# EAGLE design photonNixieBottom (EAGLE 9.0.0)
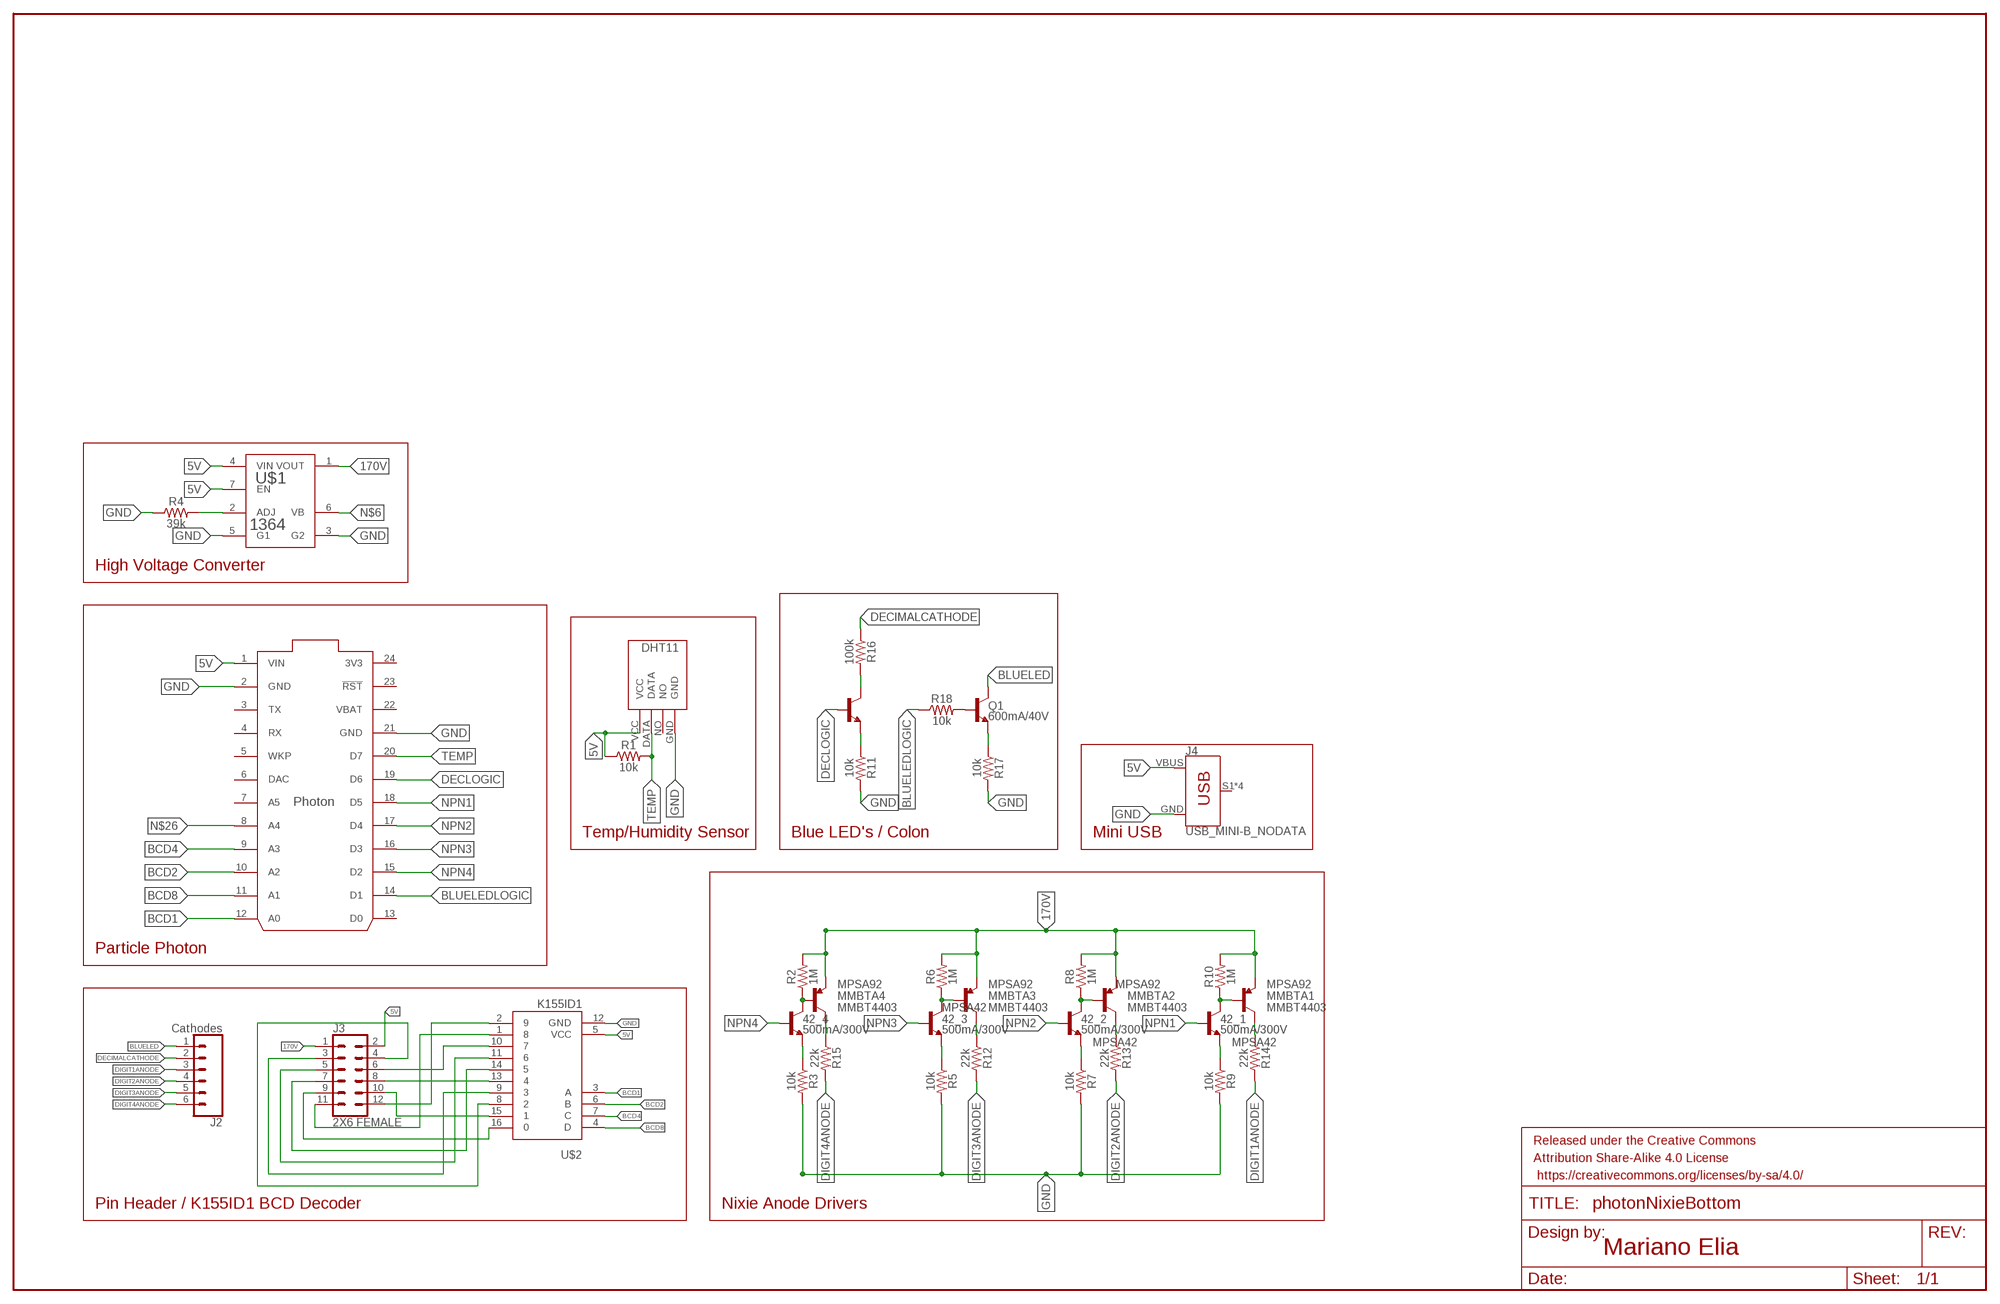
[diagram p0: schematic, sheet 1]

## Parts
42_1  500mA/300V  TRANS_NPN-MMBTA42  [SOT23-3]
42_2  500mA/300V  TRANS_NPN-MMBTA42  [SOT23-3]
42_3  500mA/300V  TRANS_NPN-MMBTA42  [SOT23-3]
42_4  500mA/300V  TRANS_NPN-MMBTA42  [SOT23-3]
FRAME1  FRAME-LEDGER  [CREATIVE_COMMONS]
J2  Cathodes  CONN_06NO_SILK_FEMALE_PTH  [1X06_NO_SILK]
J3  2X6 FEMALE  CONN_06X2PTH_FEMALE  [2X6]
J4  USB_MINI-B_NODATA  [USB-MINIB_NODATA]
MMBTA1  MMBT4403  TRANSISTOR_PNPMMBT4403  [SOT23-3]
MMBTA2  MMBT4403  TRANSISTOR_PNPMMBT4403  [SOT23-3]
MMBTA3  MMBT4403  TRANSISTOR_PNPMMBT4403  [SOT23-3]
MMBTA4  MMBT4403  TRANSISTOR_PNPMMBT4403  [SOT23-3]
MPSA7  500mA/300V  TRANS_NPN-MMBTA42  [SOT23-3]
Q1  600mA/40V  TRANS_NPN-MMBT2222AL  [SOT23-3]
R1  10k  0.3OHM-0805-1/8W-1%  [0805]
R2  1M  0.75OHM-0805-1/4W-1%  [0805]
R3  10k  0.75OHM-0805-1/4W-1%  [0805]
R4  39k  0.3OHM-0805-1/8W-1%  [0805]
R5  10k  0.75OHM-0805-1/4W-1%  [0805]
R6  1M  0.75OHM-0805-1/4W-1%  [0805]
R7  10k  0.75OHM-0805-1/4W-1%  [0805]
R8  1M  0.75OHM-0805-1/4W-1%  [0805]
R9  10k  0.75OHM-0805-1/4W-1%  [0805]
R10  1M  0.75OHM-0805-1/4W-1%  [0805]
R11  10k  0.75OHM-0805-1/4W-1%  [0805]
R12  22k  0.75OHM-0805-1/4W-1%  [0805]
R13  22k  0.75OHM-0805-1/4W-1%  [0805]
R14  22k  0.75OHM-0805-1/4W-1%  [0805]
R15  22k  0.75OHM-0805-1/4W-1%  [0805]
R16  100k  0.75OHM-0805-1/4W-1%  [0805]
R17  10k  0.75OHM-0805-1/4W-1%  [0805]
R18  10k  0.75OHM-0805-1/4W-1%  [0805]
U$1  1364  [1364]
U$2  K155ID1  [DIL16-KIT]
U$3  Temp/Humidity  DHT11  [DHT11]
U$4  PHOTON_SMDNOSILK  [PHOTON_SMDNOSILK]

## Nets
5V: J3.2 J4.VBUS R1.1 U$1.4(VIN) U$1.7(EN) U$2.5(VCC) U$3.VCC U$4.1(VIN)
170V: J3.1 MMBTA1.2(E) MMBTA2.2(E) MMBTA3.2(E) MMBTA4.2(E) R2.2 R6.2 R8.2 R10.2 U$1.1(VOUT)
BCD1: U$2.3(A) U$4.12(A0)
BCD2: U$2.6(B) U$4.10(A2)
BCD4: U$2.7(C) U$4.9(A3)
BCD8: U$2.4(D) U$4.11(A1)
BLUELED: J2.1 Q1.3(C)
BLUELEDLOGIC: R18.1 U$4.14(D1)
DECIMALCATHODE: J2.2 R16.1
DECLOGIC: MPSA7.1(B) U$4.19(D6)
DIGIT1ANODE: J2.3 R14.2
DIGIT2ANODE: J2.4 R13.2
DIGIT3ANODE: J2.5 R12.2
DIGIT4ANODE: J2.6 R15.2
GND: J4.GND R3.2 R4.1 R5.2 R7.2 R9.2 R11.2 R17.2 U$1.3(G2) U$1.5(G1) U$2.12(GND) U$3.GND U$4.2(GND) U$4.21(GND)
N$1: J3.11 U$2.1
N$2: J3.12 U$2.2
N$3: R4.2 U$1.2(ADJ)
N$4: J3.9 U$2.16
N$5: J3.10 U$2.15
N$6: U$1.6(VB)
N$7: J3.7 U$2.14
N$8: J3.8 U$2.13
N$9: J3.5 U$2.11
N$10: J3.6 U$2.10
N$11: J3.3 U$2.9
N$12: 42_4.2(E) R3.1
N$14: 42_3.2(E) R5.1
N$15: 42_4.3(C) MMBTA4.1(B) R2.1
N$16: MPSA7.2(E) R11.1
N$17: 42_2.2(E) R7.1
N$18: 42_2.3(C) MMBTA2.1(B) R8.1
N$19: J3.4 U$2.8
N$20: 42_1.2(E) R9.1
N$21: 42_1.3(C) MMBTA1.1(B) R10.1
N$22: 42_3.3(C) MMBTA3.1(B) R6.1
N$23: MMBTA3.3(C) R12.1
N$24: MMBTA4.3(C) R15.1
N$25: MMBTA2.3(C) R13.1
N$26: U$4.8(A4)
N$27: MMBTA1.3(C) R14.1
N$28: MPSA7.3(C) R16.2
N$29: Q1.1(B) R18.2
N$31: Q1.2(E) R17.1
NPN1: 42_1.1(B) U$4.18(D5)
NPN2: 42_2.1(B) U$4.17(D4)
NPN3: 42_3.1(B) U$4.16(D3)
NPN4: 42_4.1(B) U$4.15(D2)
TEMP: R1.2 U$3.DATA U$4.20(D7)
Unconnected: J4.S1(SHIELD) J4.S2(SHIELD) J4.S3(SHIELD) J4.S4(SHIELD) U$3.NO U$4.3(TX) U$4.4(RX) U$4.5(WKP) U$4.6(DAC) U$4.7(A5) U$4.13(D0) U$4.23(!RST)

## Notes on the sheet
- High Voltage Converter
- Temp/Humidity Sensor | Blue LED's / Colon | Mini USB
- Particle Photon
- Pin Header / K155ID1 BCD Decoder | Nixie Anode Drivers
- Mariano Elia

## Power pins joined to a net without a drawn wire
3V3: U$4.24(3V3)
VBAT: U$4.22(VBAT)

## Library data of the parts
42_1-42_4 MPSA7 = SparkFun-DiscreteSemi:TRANS_NPN: NPN transistor Current controlled devices typically used to amplify current or used as a switch. BC547 - COM-08928 <http://www.sparkfun.com/products/8928> (TO-92 45V 100mA) (1.Collector 2.Base 3.Emitter) 2N3904 - COM-00521 <http://www.sparkfun.com/products/521> (TO-92 40V 200mA) (1.Emitter 2.Base 3.Collector) P2N2222A - COM-12852 <http://www.sparkfun.com/products/12852> (TO-92 40V 600mA) (1.Collector 2.Base 3.Emitter); PROD_ID: TRANS-09116
FRAME1 = SparkFun-Aesthetics:FRAME-LEDGER: Schematic Frame - Ledger Standard 11x14 US Ledger frame
J2 = SparkFun-Connectors:CONN_06: Multi connection point. Often used as Generic Header-pin footprint for 0.1 inch spaced/style header connections On any of the 0.1 inch spaced packages, you can populate with these: Break Away Headers - Straight <https://www.sparkfun.com/products/116> (PRT-00116) Break Away Male Headers - Right Angle <https://www.sparkfun.com/products/553> (PRT-00553) Female Headers <https://www.sparkfun.com/products/115> (PRT-00115) Break Away Headers - Machine Pin <https://www.sparkfun.com/products/117> (PRT-00117) Break Away Female Headers - Swiss Machine Pin <https://www.sparkfun.com/products/743> (PRT-00743) Arduino Stackable Header - 6 Pin <https://www.sparkfun.com/products/9280> (PRT-09280) For SCREWTERMINALS and SPRING TERMINALS visit here: Screw Terimnals on SparkFun.com <https://www.sparkfun.com/search/results?term=Screw+Terminals> (5mm/3.5mm/2.54mm spacing) This device is also useful as a general connection point to wire up your design to another part of your project. Our various solder wires solder well into these plated through hole pads. Hook-Up Wire - Assortment (Stranded, 22 AWG) <https://www.sparkfun.com/products/11375> (PRT-11375) Hook-Up Wire - Assortment (Solid Core, 22 AWG) <https://www.sparkfun.com/products/11367> (PRT-11367) View the entire wire category on our website here <https://www.sparkfun.com/categories/141>; PROD_ID: CONN-08437
J3 = SparkFun-Connectors:CONN_06X2: Multi connection point. Often used as Generic Header-pin footprint for 0.1 inch spaced/style header connections On any of the 0.1 inch spaced packages, you can populate with these: Break Away Headers - Straight <https://www.sparkfun.com/products/116> (PRT-00116) Break Away Male Headers - Right Angle <https://www.sparkfun.com/products/553> (PRT-00553) Female Headers <https://www.sparkfun.com/products/115> (PRT-00115) Break Away Headers - Machine Pin <https://www.sparkfun.com/products/117> (PRT-00117) Break Away Female Headers - Swiss Machine Pin <https://www.sparkfun.com/products/743> (PRT-00743); PROD_ID: CONN-12423
J4 = Mariano-SparkFun-Connectors:USB_MINI-B_NODATA: USB type Mini-B Connector Breaks out 5th pin, and includes shield pins if needed. SparkFun Products: SparkFun FTDI Basic Breakout <https://www.sparkfun.com/products/9716> SparkFun XBee Explorer USB <https://www.sparkfun.com/products/11812> SparkFun Redboard <https://www.sparkfun.com/products/12757>
MMBTA1-MMBTA4 = User-Submitted:TRANSISTOR_PNP: Generic PNP BJT Double check pinouts against datasheets- not all devices are the same! MMBT3906 - 40V 200mA SOT-23 (TRANS-08052) MMBT4403 - 40V 600mA SOT-23 (TRANS-09245); PROD_ID: TRANS-09245
Q1 = SparkFun-DiscreteSemi:TRANS_NPN: NPN transistor Current controlled devices typically used to amplify current or used as a switch. BC547 - COM-08928 <http://www.sparkfun.com/products/8928> (TO-92 45V 100mA) (1.Collector 2.Base 3.Emitter) 2N3904 - COM-00521 <http://www.sparkfun.com/products/521> (TO-92 40V 200mA) (1.Emitter 2.Base 3.Collector) P2N2222A - COM-12852 <http://www.sparkfun.com/products/12852> (TO-92 40V 600mA) (1.Collector 2.Base 3.Emitter); PROD_ID: TRANS-08049
R1 R4 = SparkFun-Resistors:0.3OHM: 0.3Ω resistor A resistor is a passive two-terminal electrical component that implements electrical resistance as a circuit element. Resistors act to reduce current flow, and, at the same time, act to lower voltage levels within circuits. - Wikipedia; PROD_ID: RES-11622; VALUE: 0.3
R2 R3 R5-R18 = SparkFun-Resistors:0.75OHM: 0.75Ω resistor A resistor is a passive two-terminal electrical component that implements electrical resistance as a circuit element. Resistors act to reduce current flow, and, at the same time, act to lower voltage levels within circuits. - Wikipedia; PROD_ID: RES-08474; VALUE: 0.75
U$1 = TES:1364: TES1364 HVPS Horizontal module
U$2 = Nixie:K155ID1
U$3 = DHT11:DHT11: DHT11 Czujnik temperatury i wilgotności
U$4 = MarianoSpark:PHOTON_SMDNOSILK: Photon (without headers) - designed to be surface mounted with 7 extra exposed pads on the bottom of the board which include, 3 RGB LED outputs, /SETUP, EN (3.3V SMPS enable input), USB D+ and USB D-.

## Net classes
0 default: width 0.406 mm
1 GND: width 0.61 mm

## Board
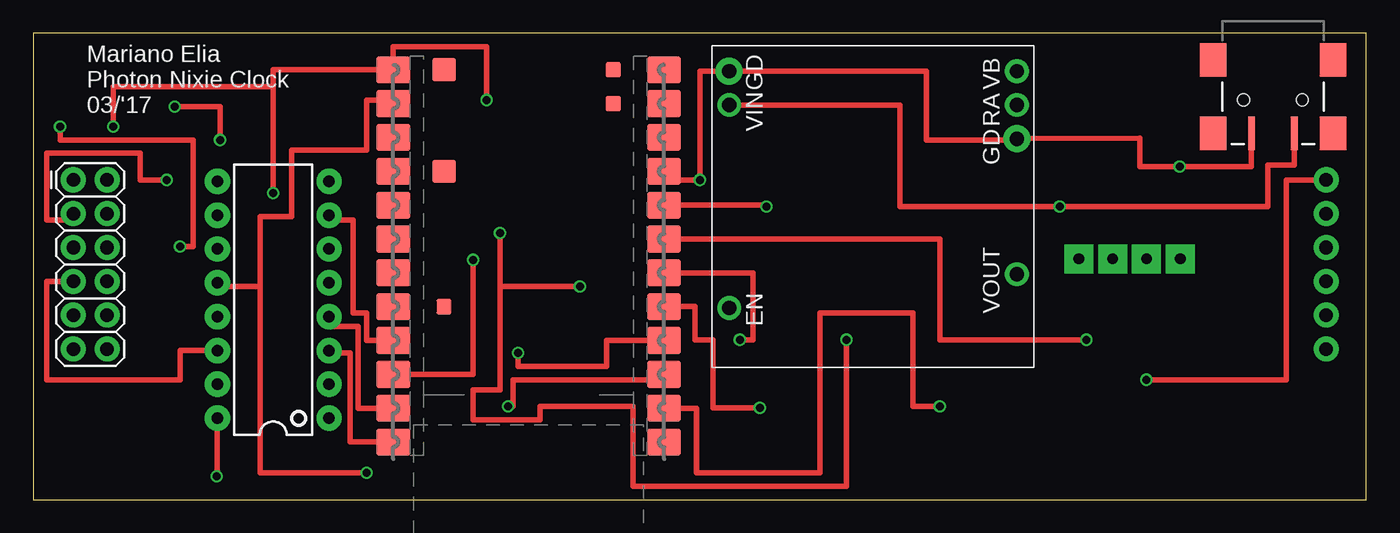
[diagram p1: board, top side]
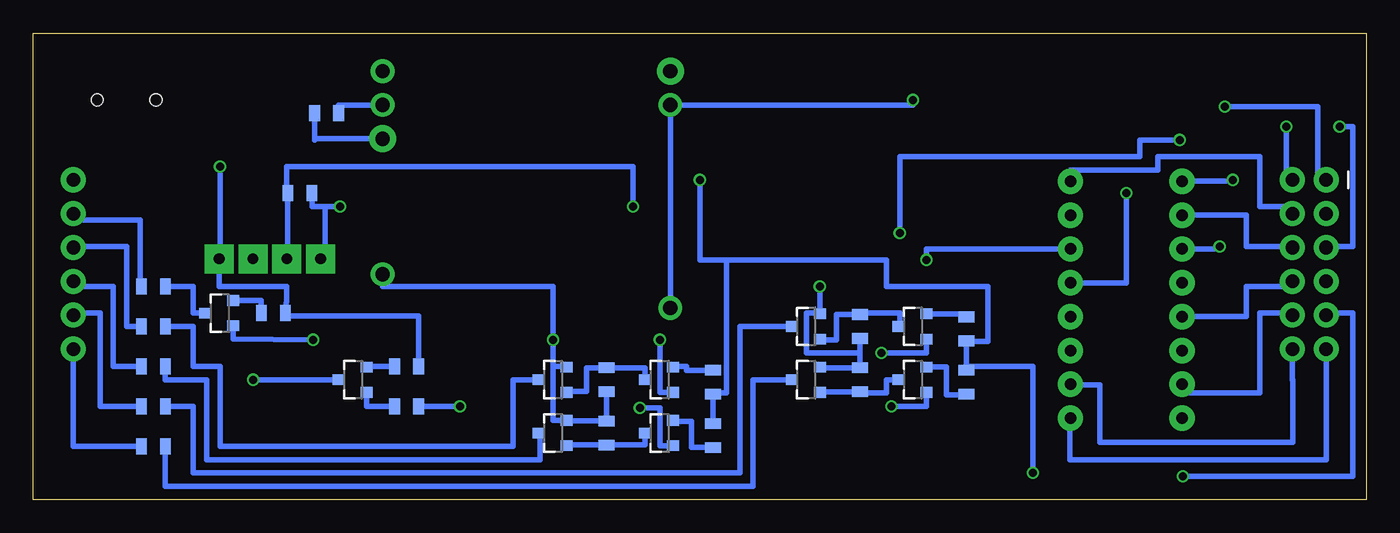
[diagram p2: board, bottom side, seen from below]

Size 100 x 35 mm. Coordinates in mm from the lower left corner, seen from the top.
Outline: 0,0 100,0 100,35 0,35 0,0
Copper layers (1*16): Top 0.035mm / dielectric 1.5mm / Bottom 0.035mm
Design rules "dirt_cheap_dirty_boards.v1": minimum track width 5mil, minimum drill 12mil, track to track 5mil, track to pad 5mil, pad to pad 5mil, via to via 5mil, smd to smd 0mil, copper to edge 10mil, drill to drill 10mil, minimum pad ring 10mil, minimum via ring 6mil, stop-mask expansion 2mil, vias tented up to drill 25mil, thermal gap 10mil

### Footprints (pad centres in the part's own frame; a part is rotated, then mirrored left to right if it is on the bottom)
SOT23-3 = smd 0.8 x 0.9: 1 -0.95,-1; 2 0.95,-1; 3 0,1.1
1X06_NO_SILK = drill 1.016 pad 1.88: 1 0,0; 2 2.54,0; 3 5.08,0; 4 7.62,0; 5 10.16,0; 6 12.7,0
2X6 = drill 1.016 pad 1.88: 1 0,0; 2 0,2.54; 3 2.54,0; 4 2.54,2.54; 5 5.08,0; 6 5.08,2.54; 7 7.62,0; 8 7.62,2.54; 9 10.16,0; 10 10.16,2.54; 11 12.7,0; 12 12.7,2.54
USB-MINIB_NODATA = smd 2.5 x 0.5: GND 2.5,-1.6; VBUS 2.5,1.6 | smd 2.5 x 2: S1 -3,4.5; S2 2.5,4.5; S3 -3,-4.5; S4 2.5,-4.5 | hole 0.9: 0,2.2; 0,-2.2
0805 = smd 0.8 x 1.2: 1 -0.9,0; 2 0.9,0
1364 = drill 1.067 pad 1.778: 1 5.08,10.795; 2 -7.62,10.795; 4 -7.62,-10.795; 6 -10.16,10.795; 7 7.62,-10.795 | drill 1.067 pad 2.032: 3 -5.08,10.795; 5 -10.16,-10.795
DIL16-KIT = drill 0.864 pad 1.905: 1 -8.89,-4.191; 2 -6.35,-4.191; 3 -3.81,-4.191; 4 -1.27,-4.191; 5 1.27,-4.191; 6 3.81,-4.191; 7 6.35,-4.191; 8 8.89,-4.191; 9 8.89,4.191; 10 6.35,4.191; 11 3.81,4.191; 12 1.27,4.191; 13 -1.27,4.191; 14 -3.81,4.191; 15 -6.35,4.191; 16 -8.89,4.191
DHT11 = drill 0.8 pad 2.184 square: DATA -1.27,-11.43; GND 3.81,-11.43; NO 1.27,-11.43; VCC -3.81,-11.43
PHOTON_SMDNOSILK = smd 2.54 x 2.032: 1 0,32.258; 2 0,29.718; 3 0,27.178; 4 0,24.638; 5 0,22.098; 6 0,19.558; 7 0,17.018; 8 0,14.478; 9 0,11.938; 10 0,9.398; 11 0,6.858; 12 0,4.318; 13 20.32,4.318; 14 20.32,6.858; 15 20.32,9.398; 16 20.32,11.938; 17 20.32,14.478; 18 20.32,17.018; 19 20.32,19.558; 20 20.32,22.098; 21 20.32,24.638; 22 20.32,27.178; 23 20.32,29.718; 24 20.32,32.258 | smd 1.778 x 1.778: 25 3.81,32.258; 26 3.81,24.638 | smd 1.143 x 1.143: 27 3.81,14.478; 28 16.51,29.718; 29 16.51,32.258

### Placement (x,y rotation side)
42_1  53,9 90 bottom
42_2  53,5 90 bottom
42_3  34,13 90 bottom
42_4  34,9 90 bottom
FRAME1  15,-12 0 top  (outside the outline)
J2  97,24 270 top
J3  3,24 270 top
J4  93,30 270 top
MMBTA1  61,9 90 bottom
MMBTA2  61,5 90 bottom
MMBTA3  42,13 90 bottom
MMBTA4  42,9 90 bottom
MPSA7  86,14 90 bottom
Q1  76,9 90 bottom
R1  80,23 180 bottom
R2  38,9 90 bottom
R3  30,8.81 90 bottom
R4  78,29 0 bottom
R5  30,12.81 270 bottom
R6  38,13 270 bottom
R7  49,4.81 90 bottom
R8  57,5 90 bottom
R9  49,8.81 270 bottom
R10  57,9 270 bottom
R11  82,14 0 bottom
R12  91,7 180 bottom
R13  91,10 180 bottom
R14  91,13 180 bottom
R15  91,4 180 bottom
R16  91,16 0 bottom
R17  72,10 0 bottom
R18  72,7 180 bottom
U$1  63,22 270 top
U$2  18,15 90 top
U$3  82.25,29.5 0 top
U$4  27,0 0 top

### Tracks (layer width: path | path; a pad name or v marks a point on that pad's centre or on a via)
5V  (via drill 0.6)
  Top 0.406: 27,32 U$4.1 | U$1.4 65,29.62 65,22 v77,22 92.62,22 92.62,25.12 94.6,25.12 J4.VBUS 94.62,27.5 | U$4.1 18,32.26 18,31 | 18,31 v18,23 | U$4.1 27,34 34,34 v34,30 | 18,31 6,31 v6,28
  Bottom 0.406: U$1.7 U$1.4 34,29.62 v34,30 | U$2.5 18,16.27 v18,23 | U$3.VCC 78.1,18.07 78.1,22 | v77,22 78.1,22 | J3.2 6,24 v6,28 | 78.1,22 79.1,22 R1.1
170V  (via drill 0.6)
  Top 0.406: v61,12 61,1 45,1 45,7 38,7 38,6 33,6 33,8.25 35,8.25 35,16 | 35,16 v41,16 | 35,16 v35,20 | v10.6,29.5 14,29.5 v14,27
  Bottom 0.406: R6.2 38,11 | 38,11 R2.2 41,9.9 MMBTA4.2 | R10.2 R8.2 60,5.9 MMBTA2.2 | 60,6 MMBTA2.2 | MMBTA2.2 61,5.95 61,10 | 61,10 60,10 MMBTA1.2 | 38,11 42,11 42,14 41,14 MMBTA3.2 v41,16 | 61,10 v61,12 61,16 73.8,16 U$1.1 | v35,20 35,25.75 17,25.75 17,27 v14,27 | v10.6,29.5 3.62,29.5 3.62,24 J3.1
BCD1
  Top 0.406: U$4.12 23.75,4.32 23.75,11 22.19,11 U$2.3
BCD2  (via drill 0.6)
  Top 0.406: U$4.10 33,9.4 v33,18
  Bottom 0.406: U$2.6 33,18.81 v33,18
BCD4
  Top 0.406: U$4.9 25,11.94 25,14 24,14 24,21 22.19,21 U$2.7
BCD8
  Top 0.406: U$4.11 24.38,6.86 24.38,13 22.19,13 U$2.4
BLUELED  (via drill 0.6)
  Top 0.406: J2.1 94,24 94,9 v83.5,9
  Bottom 0.406: v83.5,9 Q1.3
BLUELEDLOGIC  (via drill 0.6)
  Top 0.406: U$4.14 49.75,6.86 49.75,2 59,2 59,14 66,14 66,7 v68,7
  Bottom 0.406: v68,7 R18.1
DECIMALCATHODE
  Bottom 0.406: R16.1 92,16 92,21 97,21 J2.2
DECLOGIC  (via drill 0.6)
  Top 0.406: U$4.19 68,19.56 68,12 v79,12
  Bottom 0.406: v79,12 85,12.05 MPSA7.1
DIGIT1ANODE
  Bottom 0.406: R14.2 93,13 93,19 97,19 J2.3
DIGIT2ANODE
  Bottom 0.406: R13.2 94,10 94,16 97,16 J2.4
DIGIT3ANODE
  Bottom 0.406: R12.2 95,7 95,14 97,14 J2.5
DIGIT4ANODE
  Bottom 0.406: R15.2 97,4 J2.6
GND  (via drill 0.6)
  Top 0.406: 17,16 17,21.25 19.38,21.25 19.38,26.25 25,26.25 25,30 27,30 U$4.2 | 17,16 13.81,16 U$2.12 | 17,16 17,2 v25,2 | U$4.21 47.32,24 v50,24 50,32.16 U$1.5 67,32.16 67,27 73.8,27 U$1.3 83,27.12 83,25 v86,25 91.38,25 91.38,27.5 J4.GND
  Bottom 0.406: v25,2 25,10 30,10 | 30,10 R3.2 | 30,10 R5.2 30,11.88 28.38,11.88 28.38,16 36,16 36,18 48,18 | v50,24 50,18 48,18 | 78.9,27.08 U$1.3 | 78.9,27.08 R4.1 | R17.2 71.1,13.8 80.95,13.8 R11.2 81,15 81,16 86.06,16 U$3.GND 86,18.07 v86,25 | 78.9,27 78.9,27.08 | 48,18 48,8 49,8 R9.2 R7.2
N$1
  Bottom 0.406: U$2.1 22.25,6.11 22.25,3 3,3 J3.11
N$2
  Bottom 0.406: U$2.2 22.19,8.62 20,8.62 20,4.3 5.5,4.3 5.5,9 5.54,9 J3.12
N$3
  Bottom 0.406: R4.2 77.1,29.62 U$1.2
N$4  (via drill 0.6)
  Top 0.406: v13.75,1.75 13.81,2 U$2.16
  Bottom 0.406: v13.75,1.75 1,1.75 1,14 3,14 J3.9
N$5
  Bottom 0.406: U$2.15 13.81,8 8,8 8,14 5.54,14 J3.10
N$7
  Top 0.406: U$2.14 11,11.19 11,9 1,9 1,16.38 J3.7
N$8
  Bottom 0.406: U$2.13 9,13.73 9,16 5.54,16 J3.8
N$9  (via drill 0.6)
  Top 0.406: v11,19 12,19 12,27 2,27 v2,28
  Bottom 0.406: U$2.11 11,18.81 v11,19 | v2,28 1,28 1,19 3,19 J3.5
N$10
  Bottom 0.406: U$2.10 9,21.35 9,19 5.54,19 J3.6
N$11  (via drill 0.6)
  Top 0.406: v10,24 8,24 8,26 1,26 1,21 3,21 J3.3
  Bottom 0.406: U$2.9 10,23.89 v10,24
N$12
  Bottom 0.406: 42_4.2 31.5,9.95 31.5,7.88 30,7.88 R3.1
N$14
  Bottom 0.406: 42_3.2 30,13.95 R5.1
N$15
  Bottom 0.406: 42_4.3 36,9 36,8 38,8 R2.1 41,8.1 MMBTA4.1
N$16
  Bottom 0.406: MPSA7.2 82.9,14.95 R11.1
N$17
  Bottom 0.406: 42_2.2 52,5.88 50.62,5.88 50.62,3.91 R7.1
N$18
  Bottom 0.406: MMBTA2.1 60,4.1 R8.1 54.1,4.1 42_2.3
N$19
  Bottom 0.406: 22,23.89 U$2.8 22.19,24.75 15.62,24.75 15.62,25.75 8,25.75 8,22 5.54,22 J3.4
N$20
  Bottom 0.406: 42_1.2 52,10 51,10 51,9.71 R9.1
N$21
  Bottom 0.406: 42_1.3 54.1,9.9 R10.1 58.5,9.9 58.5,8.12 60,8.12 MMBTA1.1
N$22
  Bottom 0.406: 42_3.3 35,13 35,14 38,14 R6.1 39.75,13.9 39.75,12 41,12 MMBTA3.1
N$23
  Bottom 0.406: MMBTA3.3 47,13 47,2 88,2 88,7 R12.1
N$24
  Bottom 0.406: MMBTA4.3 46,9 46,1 90.1,1 R15.1
N$25
  Bottom 0.406: MMBTA2.3 62,5 62,3 87,3 87,9 90.1,9 R13.1
N$27
  Bottom 0.406: R14.1 88,13 88,10 86,10 86,4 64,4 64,9 MMBTA1.3
N$28
  Bottom 0.406: MPSA7.3 88,14 88,16 R16.2
N$29
  Bottom 0.406: R18.2 75,7 Q1.1
N$31
  Bottom 0.406: Q1.2 74.95,10 R17.1
NPN1  (via drill 0.6)
  Top 0.406: U$4.18 54,17.02 54,12 v53,12
  Bottom 0.406: 42_1.1 53,8.05 v53,12
NPN2  (via drill 0.6)
  Top 0.406: v54.5,6.88 51,6.88 51,12 49.62,12 49.62,14.48 U$4.17
  Bottom 0.406: 42_2.1 53,4.05 53,6.88 v54.5,6.88
NPN3  (via drill 0.6)
  Top 0.406: U$4.16 43,11.94 43,10 36.38,10 v36.38,11
  Bottom 0.406: 42_3.1 33,11 v36.38,11
NPN4  (via drill 0.6)
  Top 0.406: v35.62,7 36,7 36,9 47.32,9 U$4.15
  Bottom 0.406: 42_4.1 33,7 v35.62,7
TEMP  (via drill 0.6)
  Top 0.406: U$4.20 55,22.1 v55,22
  Bottom 0.406: U$3.DATA 80.9,18.07 R1.2 81,23 81,25 55,25 v55,22

### Text on the board
tNames: Mariano Elia / Photon Nixie Clock / 03/'17